# Altium schematic sheet SBUS.SchDoc: SBUS Inverter
size A4; Author: Miłosz Werner & Julia Rzepka; DrawnBy: Miłosz Werner; Organization: Wroclaw University of Science and Technology; Revision: 1.0; SheetNumber: 4; SheetTotal: 8
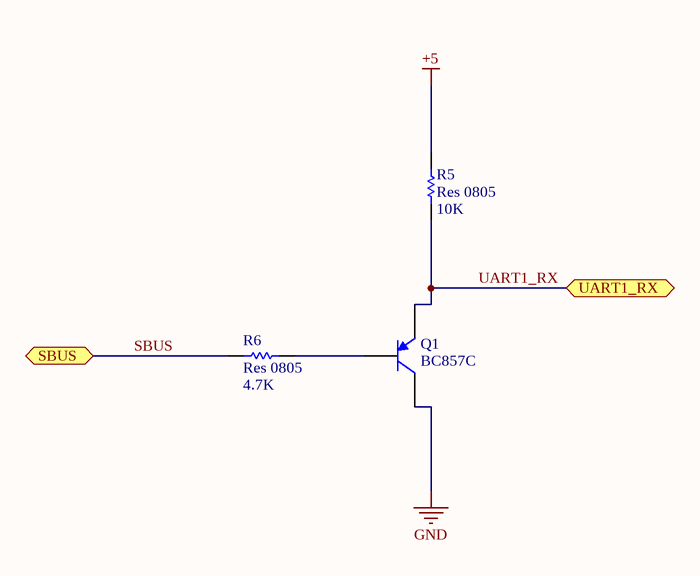
[diagram p0: SBUS.SchDoc]

## Parts
Q1  BC857C  [INF-SOT23_N]
R5  Res 0805  value 10K  [RESC2013X50X30LL20T20]
R6  Res 0805  value 4.7K  [RESC2013X50X30LL20T20]

## Ports
SBUS (bidir), UART1_RX (bidir)

## Nets
+5: R5.2
GND: Q1.3(C)
SBUS: R6.2 ; port SBUS
UART1_RX: Q1.2(E) R5.1 ; port UART1_RX
NetQ1_1: Q1.1(B) R6.1

## Library data of the parts
Q1 = CMP-1177-00039-1: PNP Silicon AF Transistor, 45 V VCEO, 100 mA IC, SOT23, Reel, Green; Manufacturer: Infineon; VCBO (max): 50Â V; fT (typ): 250Â MHz; ICBO (max): 15Â nA; IC (max): 100Â mA; Green: TRUE; IBM (max): 200Â mA; VEBO (max): 5Â V; VCEO (max): 45Â V; Ptot (max): 330Â mW; PackageDescription: 3-Pin Small Outline Transistor Package, 1.3 x 2.9 mm Body, 0.95 mm Pitch; ComponentLink2Description: Datasheet; PackageReference: SOT23; ComponentLink3Description: Package Specification; ComponentLink1URL: http://www.infineon.com/; ComponentLink1Description: Manufacturer URL; Mounting Technology: Surface Mount; PackageVersion: Apr-08; ComponentLink3URL: http://www.infineon.com/dgdl/SOT23-Package_Overview.pdf?folderId=db3a30431936bc4b0119532290053c66&fileId=db3a30431936bc4b0119533468123c85; ComponentLink2URL: http://www.infineon.com/dgdl/bc857series_bc858series_bc859series_bc860series.pdf?folderId=db3a304314dca389011541d30fa21656&fileId=db3a304314dca389011541da0e3a1661; Polarity: PNP; ICM (max): 200Â mA; PartNumber: BC857C; Packing: Reel
R5 R6 = CMP-2001-03735-1: Resistor